# Altium schematic sheet Microcontroller.SchDoc
size B; DrawnBy: Ross Harvey; Engineer: Ross Harvey; Revision: A; SheetNumber: 1; DocumentName: Hades Microcontroller (Satellite)